# Altium project Vehicle Control Board REVAC.PrjPcb
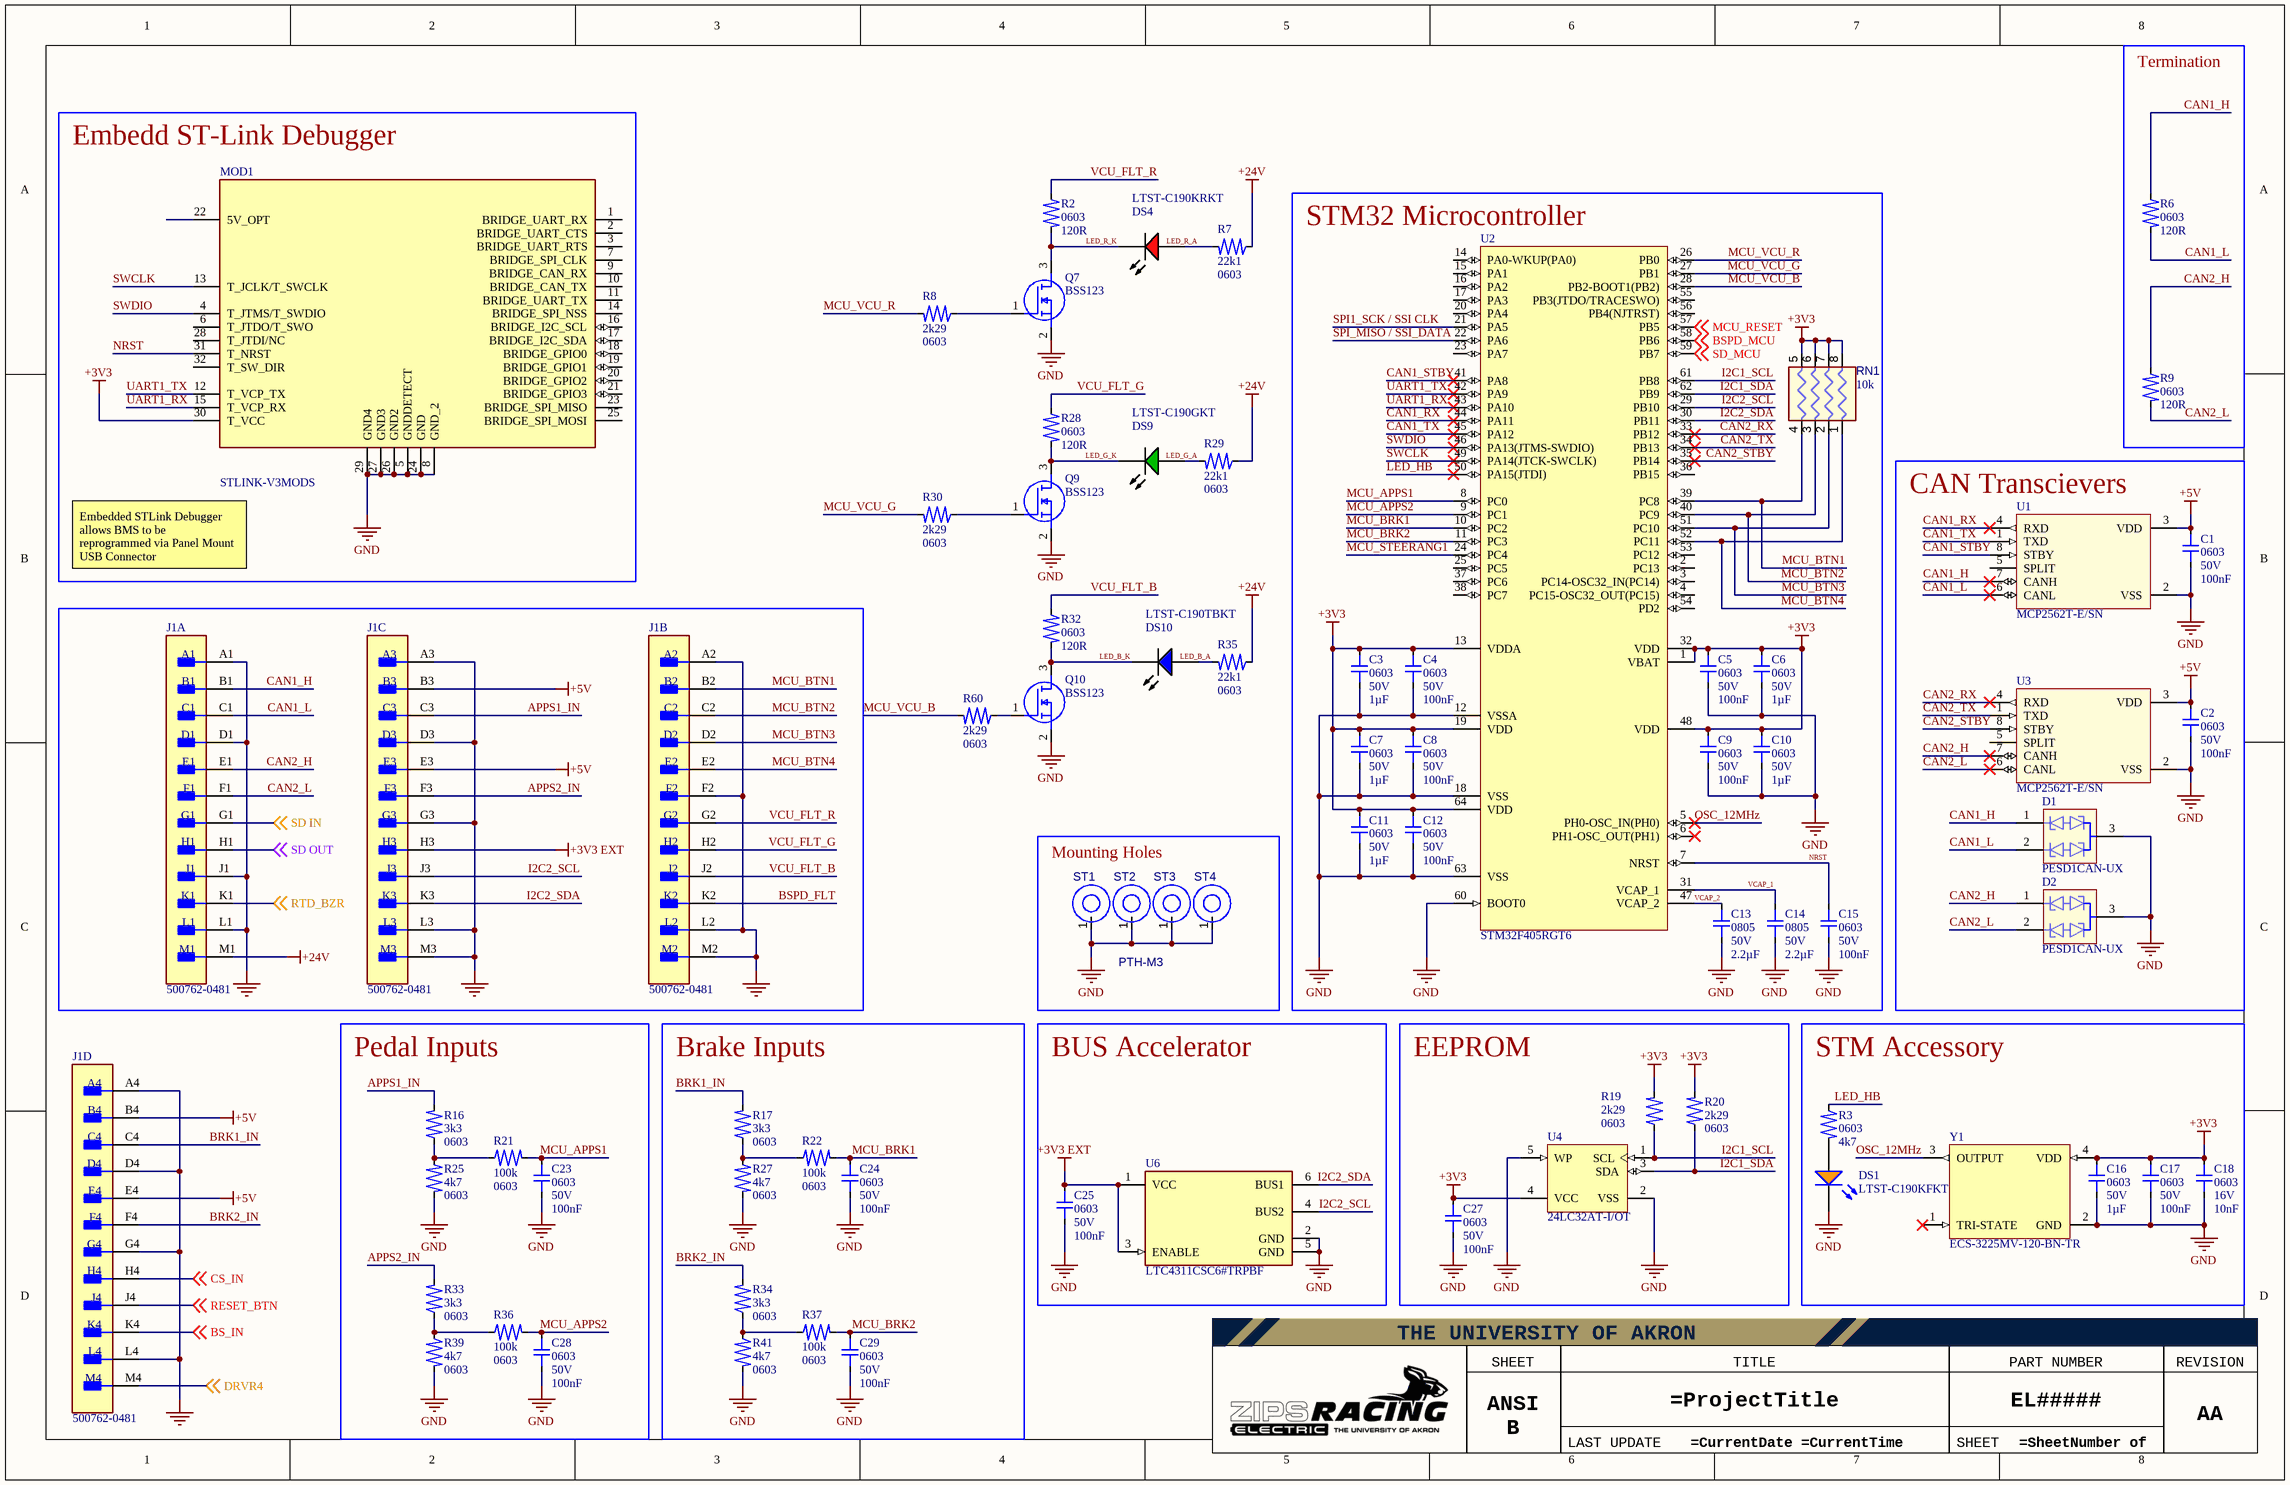
[diagram p0: STM32.SchDoc]
Comment_1: Initial Release of Schematic; Date_1: 5/17/2024; DrawnBy_1: Ethan Zifzal; PartNumber: EL#####; ProjectTitle: STM32F405 MCU Template; Revision: AA; Revision_1: AA
4 sheets, 149 parts. Net scope: global (net labels, ports and power ports of the same name join across sheets).
Board file: VCU PCB REVAC.PcbDoc
Sheets:
  Sheet1.SchDoc
  STM32.SchDoc
  Pump Fan Control.SchDoc
  BSPD.SchDoc

## Sheet Sheet1.SchDoc
size Tabloid; SheetNumber: 1; SheetTotal: 4

### Notes on the sheet
- REVISION
- DATE
- DRAWN BY
- COMMENT
- Notes
- THE UNIVERSITY OF AKRON
- SHEET SIZE
- TITLE
- PART NUMBER
- ANSI B
- LAST UPDATE
- SHEET

## Sheet STM32.SchDoc
size Tabloid; SheetNumber: 2; SheetTotal: 4

### Parts
C1  value 100nF  Footprint: 0603  Voltage: 50V  [CAP-0603-Generic]  (hidden comment: Capacitor 100nF 0603 5%)
C2  value 100nF  Footprint: 0603  Voltage: 50V  [CAP-0603-Generic]  (hidden comment: Capacitor 100nF 0603 5%)
C3  value 1µF  Footprint: 0603  Voltage: 50V  [CAP-0603-Generic]  (hidden comment: Capacitor 1uF 0603 5%)
C4  value 100nF  Footprint: 0603  Voltage: 50V  [CAP-0603-Generic]  (hidden comment: Capacitor 100nF 0603 5%)
C5  value 100nF  Footprint: 0603  Voltage: 50V  [CAP-0603-Generic]  (hidden comment: Capacitor 100nF 0603 5%)
C6  value 1µF  Footprint: 0603  Voltage: 50V  [CAP-0603-Generic]  (hidden comment: Capacitor 1uF 0603 5%)
C7  value 1µF  Footprint: 0603  Voltage: 50V  [CAP-0603-Generic]  (hidden comment: Capacitor 1uF 0603 5%)
C8  value 100nF  Footprint: 0603  Voltage: 50V  [CAP-0603-Generic]  (hidden comment: Capacitor 100nF 0603 5%)
C9  value 100nF  Footprint: 0603  Voltage: 50V  [CAP-0603-Generic]  (hidden comment: Capacitor 100nF 0603 5%)
C10  value 1µF  Footprint: 0603  Voltage: 50V  [CAP-0603-Generic]  (hidden comment: Capacitor 1uF 0603 5%)
C11  value 1µF  Footprint: 0603  Voltage: 50V  [CAP-0603-Generic]  (hidden comment: Capacitor 1uF 0603 5%)
C12  value 100nF  Footprint: 0603  Voltage: 50V  [CAP-0603-Generic]  (hidden comment: Capacitor 100nF 0603 5%)
C13  value 2.2µF  Footprint: 0805  Voltage: 50V  [CAP-0805]  (hidden comment: Capacitor 2.2F 0805 5%)
C14  value 2.2µF  Footprint: 0805  Voltage: 50V  [CAP-0805]  (hidden comment: Capacitor 2.2F 0805 5%)
C15  value 100nF  Footprint: 0603  Voltage: 50V  [CAP-0603-Generic]  (hidden comment: Capacitor 100nF 0603 5%)
C16  value 1µF  Footprint: 0603  Voltage: 50V  [CAP-0603-Generic]  (hidden comment: Capacitor 1uF 0603 5%)
C17  value 100nF  Footprint: 0603  Voltage: 50V  [CAP-0603-Generic]  (hidden comment: Capacitor 100nF 0603 5%)
C18  value 10nF  Footprint: 0603  Voltage: 16V  [CAP-0603-Generic]  (hidden comment: Capacitor 10nF 0603 5%)
C23  value 100nF  Footprint: 0603  Voltage: 50V  [CAP-0603-Generic]  (hidden comment: Capacitor 100nF 0603 5%)
C24  value 100nF  Footprint: 0603  Voltage: 50V  [CAP-0603-Generic]  (hidden comment: Capacitor 100nF 0603 5%)
C25  value 100nF  Footprint: 0603  Voltage: 50V  [CAP-0603-Generic]  (hidden comment: Capacitor 100nF 0603 5%)
C27  value 100nF  Footprint: 0603  Voltage: 50V  [CAP-0603-Generic]  (hidden comment: Capacitor 100nF 0603 5%)
C28  value 100nF  Footprint: 0603  Voltage: 50V  [CAP-0603-Generic]  (hidden comment: Capacitor 100nF 0603 5%)
C29  value 100nF  Footprint: 0603  Voltage: 50V  [CAP-0603-Generic]  (hidden comment: Capacitor 100nF 0603 5%)
D1  PESD1CAN-UX  [FP-SOT323-MFG]
D2  PESD1CAN-UX  [FP-SOT323-MFG]
DS1  LTST-C190KFKT  [LTST-C190KFKT_V]
DS4  LTST-C190KRKT  [LTST-C191KRKT_V]
DS9  LTST-C190GKT  [LTST-C190GKT_V]
DS10  LTST-C190TBKT  [LTST-C190TBKT-2_V]
J1  500762-0481  [FP-500762-0481-MFG]  (parts A,B,C,D of 4)
MOD1  STLINK-V3MODS  [STLINK-V3MODS-Footprint-1]
Q7  BSS123  [SOT96P237X111-3N]
Q9  BSS123  [SOT96P237X111-3N]
Q10  BSS123  [SOT96P237X111-3N]
R2  value 120R  Footprint: 0603  [RES-0603-Generic]  (hidden comment: Resistor 120R 0603 1%)
R3  value 4k7  Footprint: 0603  [RES-0603-Generic]  (hidden comment: Resistor 4k7 0603 1%)
R6  value 120R  Footprint: 0603  [RES-0603-Generic]  (hidden comment: Resistor 120R 0603 1%)
R7  value 22k1  Footprint: 0603  [RES-0603-Generic]  (hidden comment: Resistor 22k1 0603 1%)
R8  value 2k29  Footprint: 0603  [RES-0603-Generic]  (hidden comment: Resistor 2k49 0603 1%)
R9  value 120R  Footprint: 0603  [RES-0603-Generic]  (hidden comment: Resistor 120R 0603 1%)
R16  value 3k3  Footprint: 0603  [RES-0603-Generic]  (hidden comment: Resistor 3k3 0603 1%)
R17  value 3k3  Footprint: 0603  [RES-0603-Generic]  (hidden comment: Resistor 3k3 0603 1%)
R19  value 2k29  Footprint: 0603  [RES-0603-Generic]  (hidden comment: Resistor 2k49 0603 1%)
R20  value 2k29  Footprint: 0603  [RES-0603-Generic]  (hidden comment: Resistor 2k49 0603 1%)
R21  value 100k  Footprint: 0603  [RES-0603-Generic]  (hidden comment: Resistor 100k 0603 1%)
R22  value 100k  Footprint: 0603  [RES-0603-Generic]  (hidden comment: Resistor 100k 0603 1%)
R25  value 4k7  Footprint: 0603  [RES-0603-Generic]  (hidden comment: Resistor 4k7 0603 1%)
R27  value 4k7  Footprint: 0603  [RES-0603-Generic]  (hidden comment: Resistor 4k7 0603 1%)
R28  value 120R  Footprint: 0603  [RES-0603-Generic]  (hidden comment: Resistor 120R 0603 1%)
R29  value 22k1  Footprint: 0603  [RES-0603-Generic]  (hidden comment: Resistor 22k1 0603 1%)
R30  value 2k29  Footprint: 0603  [RES-0603-Generic]  (hidden comment: Resistor 2k49 0603 1%)
R32  value 120R  Footprint: 0603  [RES-0603-Generic]  (hidden comment: Resistor 120R 0603 1%)
R33  value 3k3  Footprint: 0603  [RES-0603-Generic]  (hidden comment: Resistor 3k3 0603 1%)
R34  value 3k3  Footprint: 0603  [RES-0603-Generic]  (hidden comment: Resistor 3k3 0603 1%)
R35  value 22k1  Footprint: 0603  [RES-0603-Generic]  (hidden comment: Resistor 22k1 0603 1%)
R36  value 100k  Footprint: 0603  [RES-0603-Generic]  (hidden comment: Resistor 100k 0603 1%)
R37  value 100k  Footprint: 0603  [RES-0603-Generic]  (hidden comment: Resistor 100k 0603 1%)
R39  value 4k7  Footprint: 0603  [RES-0603-Generic]  (hidden comment: Resistor 4k7 0603 1%)
R41  value 4k7  Footprint: 0603  [RES-0603-Generic]  (hidden comment: Resistor 4k7 0603 1%)
R60  value 2k29  Footprint: 0603  [RES-0603-Generic]  (hidden comment: Resistor 2k49 0603 1%)
RN1  value 10k  [BOUR-CAY16-J4_V]  (hidden comment: CAY16-103J4LF)
ST1  PTH-M3  [PTH-M2D5X5]  (no BOM)
ST2  PTH-M3  [PTH-M2D5X5]  (value not drawn)  (no BOM)
ST3  PTH-M3  [PTH-M2D5X5]  (value not drawn)  (no BOM)
ST4  PTH-M3  [PTH-M2D5X5]  (value not drawn)  (no BOM)
U1  MCP2562T-E/SN  [MCP2562T-E_SN-Footprint-1]
U2  STM32F405RGT6  [STM-LQFP64_V]
U3  MCP2562T-E/SN  [MCP2562T-E_SN-Footprint-1]
U4  24LC32AT-I/OT  [SOT-23-OT5_L]
U6  LTC4311CSC6#TRPBF  [FP-SC6-6-05-08-1638-IPC_A]
Y1  ECS-3225MV-120-BN-TR  [ECS-3225MV-120-BN-TR-Footprint-1]

### Blocks framed on the sheet
Termination: R6 R9
Embedd ST-Link Debugger: MOD1
STM32 Microcontroller: C3-C15 RN1 U2
CAN Transcievers: C1 C2 D1 D2 U1 U3
Mounting Holes: ST1-ST4
Pedal Inputs: C23 C28 R16 R21 R25 R33 R36 R39
Brake Inputs: C24 C29 R17 R22 R27 R34 R37 R41
BUS Accelerator: C25 U6
EEPROM: C27 R19 R20 U4
STM Accessory: C16-C18 DS1 R3 Y1

### Nets
+3V3: C3.2 C4.2 C5.2 C6.2 C7.2 C8.2 C9.2 C10.2 C11.2 C12.2 C16.2 C17.2 C18.2 C27.2 MOD1.30(T_VCC) R19.2 R20.2 RN1.5 RN1.6 RN1.7 RN1.8 U2.1(VBAT) U2.13(VDDA) U2.19(VDD) U2.32(VDD) U2.48(VDD) U2.64(VDD) U4.4(VCC) Y1.4(VDD)
+3V3 EXT: C25.2 J1.H3 U6.1(VCC) U6.3(ENABLE)
+5V: C1.2 C2.2 J1.B3 J1.B4 J1.E3 J1.E4 U1.3(VDD) U3.3(VDD)
+24V: J1.M1 R7.1 R29.1 R35.1
GND: C1.1 C2.1 C3.1 C4.1 C5.1 C6.1 C7.1 C8.1 C9.1 C10.1 C11.1 C12.1 C13.1 C14.1 C15.1 C16.1 C17.1 C18.1 C23.1 C24.1 C25.1 C27.1 C28.1 C29.1 D1.3(common_cathode) D2.3(common_cathode) DS1.2(K) J1.A1 J1.A2 J1.A3 J1.A4 J1.D1 J1.D3 J1.D4 J1.F2 J1.G3 J1.G4 J1.J1 J1.L1 J1.L2 J1.L3 J1.L4 J1.M2 J1.M3 MOD1.5(GNDDETECT) MOD1.8(GND_2) MOD1.24(GND) MOD1.26(GND2) MOD1.27(GND3) MOD1.29(GND4) Q7.2(S) Q9.2(S) Q10.2(S) R25.2 R27.2 R39.2 R41.2 ST1.1(H1) ST2.1(H1) ST3.1(H1) ST4.1(H1) U1.2(VSS) U2.12(VSSA) U2.18(VSS) U2.60(BOOT0) U2.63(VSS) U3.2(VSS) U4.2(VSS) U4.5(WP) U6.2(GND) U6.5(GND) Y1.2(GND)
APPS1_IN: J1.C3 R16.2
APPS2_IN: J1.F3 R33.2
BRK1_IN: J1.C4 R17.2
BRK2_IN: J1.F4 R34.2
BS_IN: J1.K4 ; off-sheet BS_IN
BSPD_FLT: J1.K2
BSPD_MCU: U2.58(PB6) ; off-sheet BSPD_MCU
CAN1_H: D1.1(cathode_1) J1.B1 R6.1 U1.7(CANH)
CAN1_L: D1.2(cathode_2) J1.C1 R6.2 U1.6(CANL)
CAN1_RX: U1.4(RXD) U2.44(PA11)
CAN1_STBY: U1.8(STBY) U2.41(PA8)
CAN1_TX: U1.1(TXD) U2.45(PA12)
CAN2_H: D2.1(cathode_1) J1.E1 R9.1 U3.7(CANH)
CAN2_L: D2.2(cathode_2) J1.F1 R9.2 U3.6(CANL)
CAN2_RX: U2.33(PB12) U3.4(RXD)
CAN2_STBY: U2.35(PB14) U3.8(STBY)
CAN2_TX: U2.34(PB13) U3.1(TXD)
CS_IN: J1.H4 ; off-sheet CS_IN
DRVR4: J1.M4 ; off-sheet DRVR4
I2C1_SCL: R19.1 U2.61(PB8) U4.1(SCL)
I2C1_SDA: R20.1 U2.62(PB9) U4.3(SDA)
I2C2_SCL: J1.J3 U2.29(PB10) U6.4(BUS2)
I2C2_SDA: J1.K3 U2.30(PB11) U6.6(BUS1)
LED_B_A: DS10.1(A) R35.2
LED_B_K: DS10.2(K) Q10.3(D) R32.2
LED_G_A: DS9.1(A) R29.2
LED_G_K: DS9.2(K) Q9.3(D) R28.2
LED_HB: R3.1 U2.50(PA15(JTDI))
LED_R_A: DS4.1(A) R7.2
LED_R_K: DS4.2(K) Q7.3(D) R2.2
MCU_APPS1: C23.2 R21.2 U2.8(PC0)
MCU_APPS2: C28.2 R36.2 U2.9(PC1)
MCU_BRK1: C24.2 R22.2 U2.10(PC2)
MCU_BRK2: C29.2 R37.2 U2.11(PC3)
MCU_BTN1: J1.B2 RN1.4 U2.39(PC8)
MCU_BTN2: J1.C2 RN1.3 U2.40(PC9)
MCU_BTN3: J1.D2 RN1.2 U2.51(PC10)
MCU_BTN4: J1.E2 RN1.1 U2.52(PC11)
MCU_RESET: U2.57(PB5) ; off-sheet MCU_RESET
MCU_STEERANG1: U2.24(PC4)
MCU_VCU_B: R60.2 U2.28(PB2-BOOT1(PB2))
MCU_VCU_G: R30.2 U2.27(PB1)
MCU_VCU_R: R8.2 U2.26(PB0)
NRST: C15.2 MOD1.31(T_NRST) U2.7(NRST)
OSC_12MHz: U2.5(PH0-OSC_IN(PH0)) Y1.3(OUTPUT)
RESET_BTN: J1.J4 ; off-sheet RESET_BTN
RTD_BZR: J1.K1 ; off-sheet RTD_BZR
SD IN: J1.G1 ; off-sheet SD IN
SD OUT: J1.H1 ; off-sheet SD OUT
SD_MCU: U2.59(PB7) ; off-sheet SD_MCU
SPI1_SCK / SSI CLK: U2.21(PA5)
SPI_MISO / SSI_DATA: U2.22(PA6)
SWCLK: MOD1.13(T_JCLK/T_SWCLK) U2.49(PA14(JTCK-SWCLK))
SWDIO: MOD1.4(T_JTMS/T_SWDIO) U2.46(PA13(JTMS-SWDIO))
UART1_RX: MOD1.15(T_VCP_RX) U2.43(PA10)
UART1_TX: MOD1.12(T_VCP_TX) U2.42(PA9)
VCAP_1: C14.2 U2.31(VCAP_1)
VCAP_2: C13.2 U2.47(VCAP_2)
VCU_FLT_B: J1.J2 R32.1
VCU_FLT_G: J1.H2 R28.1
VCU_FLT_R: J1.G2 R2.1
NetDS1_1: DS1.1(A) R3.2
NetQ7_1: Q7.1(G) R8.1
NetQ9_1: Q9.1(G) R30.1
NetQ10_1: Q10.1(G) R60.1
NetR16_1: R16.1 R21.1 R25.1
NetR17_1: R17.1 R22.1 R27.1
NetR33_1: R33.1 R36.1 R39.1
NetR34_1: R34.1 R37.1 R41.1

Not connected (* = marked no-connect by the designer): MOD1 1(BRIDGE_UART_RX) 2(BRIDGE_UART_CTS) 3(BRIDGE_UART_RTS) 6(T_JTDO/T_SWO) 7(BRIDGE_SPI_CLK) 9(BRIDGE_CAN_RX) 10(BRIDGE_CAN_TX) 11(BRIDGE_UART_TX) 14(BRIDGE_SPI_NSS) 16(BRIDGE_I2C_SCL) 17(BRIDGE_I2C_SDA) 18(BRIDGE_GPIO0) 19(BRIDGE_GPIO1) 20(BRIDGE_GPIO2) 21(BRIDGE_GPIO3) 22(5V_OPT) 23(BRIDGE_SPI_MISO) 25(BRIDGE_SPI_MOSI) 28(T_JTDI/NC) 32(T_SW_DIR); U1 5(SPLIT); U2 2(PC13) 3(PC14-OSC32_IN(PC14)) 4(PC15-OSC32_OUT(PC15)) 6(PH1-OSC_OUT(PH1))* 14(PA0-WKUP(PA0)) 15(PA1) 16(PA2) 17(PA3) 20(PA4) 23(PA7) 25(PC5) 36(PB15) 37(PC6) 38(PC7) 53(PC12) 54(PD2) 55(PB3(JTDO/TRACESWO)) 56(PB4(NJTRST)); U3 5(SPLIT); Y1 1(TRI-STATE)*

### Notes on the sheet
- Embedded STLink Debugger allows BMS to be reprogrammed via Panel Mount USB Connector
- THE UNIVERSITY OF AKRON
- SHEET SIZE
- TITLE
- PART NUMBER
- REVISION
- ANSI B
- LAST UPDATE
- SHEET

### Library data of the parts
C1 C2 C4 C5 C8 C9 C12 C15 C17 C23-C25 C27-C29 = CMP-00030-2: Capacitor, 0603, 5%; Max Operating Temperature: 125°C; Min Operating Temperature: -55°C
C3 C6 C7 C10 C11 C16 = CMP-00043-1: Capacitor, 0603, 5%; Min Operating Temperature: -55°C; Max Operating Temperature: 85°C
C13 C14 = CMP-00042-1: Capacitor, 0805, 5%
C18 = CMP-00044-1: Capacitor, 0603, 5%; Min Operating Temperature: -55°C; Max Operating Temperature: 125°C
D1 D2 = CMP-004-00033-2: Trans Voltage Suppressor Diode, 150W, 24V V(RWM), Bidirectional, 2 Element, Silicon
DS1 = CMP-007-00023-2: LED Uni-Color Orange, 75 mW, 30 mA, -35 to 85 degC, 2-Pin SMD, RoHS, Tape and Reel; Manufacturer: Lite-On; Power: 75mW; Luminous Intensity: 90mcd; Nominal Vf: 2V; Lens Style: Diffused; Forward Current: 20mA; Viewing Angle: 130degrees; Max Operating Temperature: 85°C; Manufacturer URL: http://www.us.liteon.com/; Package Description: 2-Pin Surface Mount Device, Body 1.6 x 0.8 mm; Package Quantity: 3000; Pins: 2; Min Operating Temperature: -55°C; Mounting Technology: SM; Colour: Orange; Packaging: TapeandReel; Case/Package: 0603; Datasheet Version: Rev. I, 09/2011; Illumination Colour: Orange; Datasheet URL: http://optoelectronics.liteon.com/upload/download/DS-22-99-0186/S_110_LTST-C190KFKT.pdf; Package Reference: C190KFKT; RoHS Compliant: True; Forward Voltage: 2V
DS4 = CMP-007-00024-2: LED Uni-Color Red, 62.5 mW, 25 mA, -30 to 85 degC, 2-Pin SMD, RoHS, Tape and Reel; Manufacturer: Lite-On; Power: 75mW; Forward Voltage: 2V; Luminous Intensity: 54mcd; Lens Style: Diffused; Viewing Angle: 130degrees; Forward Current: 20mA; Manufacturer URL: http://www.us.liteon.com/; Case/Package: 0603; Datasheet Version: Rev. F, 05/2013; Package Reference: C191KRKT; Datasheet URL: http://optoelectronics.liteon.com/upload/download/DS-22-99-0151/S_110_LTST-C190KRKT.pdf; Package Description: 2-Pin Surface Mount Device, Body 1.6 x 0.8 mm; Nominal Vf: 2V; Packaging: TapeandReel; RoHS Compliant: True; Pins: 2; Illumination Colour: Red; Colour: Red; Mounting Technology: SM; Package Quantity: 3000; Min Operating Temperature: -55°C; Max Operating Temperature: 85°C
DS9 = CMP-007-00022-2: LED Uni-Color Green, 100 mW, 30 mA, -55 to 85 degC, 2-Pin SMD, RoHS, Tape and Reel; Manufacturer: Lite-On; Power: 100mW; Forward Voltage: 2.1V; Viewing Angle: 130degrees; Forward Current: 20mA; Luminous Intensity: 6mcd; Lens Style: Clear; Manufacturer URL: http://www.us.liteon.com/; RoHS Compliant: True; Colour: Green; Package Description: 2-Pin Surface Mount Device, Body 1.6 x 0.8 mm; Datasheet URL: http://datasheet.octopart.com/LTST-C190GKT-Lite-On-datasheet-158530.pdf; Datasheet Version: Dec-06; Mounting Technology: SM; Case/Package: 0603; Package Reference: C190GKT; Packaging: TapeandReel; Min Operating Temperature: -55°C; Nominal Vf: 2.1V; Package Quantity: 3000; Illumination Colour: Green; Max Operating Temperature: 85°C; Pins: 2
DS10 = CMP-007-00026-2: LED Uni-Color Blue, 76 mW, 20 mA, -20 to 80 degC, 2-Pin SMD, RoHS, Tape and Reel; Manufacturer: Lite-On; Forward Voltage: 2.8V; Lens Style: Diffused; Luminous Intensity: 28mcd; Forward Current: 20mA; Viewing Angle: 130degrees; Nominal Vf: 3.3V; Packaging: TapeandReel; Min Operating Temperature: -20°C; Illumination Colour: Blue; Package Quantity: 3000; Pins: 2; Mounting Technology: SM; Package Reference: C190TBKT-2; Package Description: 2-Pin Surface Mount Device, Body 1.6 x 0.8 mm; RoHS Compliant: True; Datasheet URL: http://optoelectronics.liteon.com/upload/download/DS-22-99-0224/S_110_LTST-C190TBKT(0630).pdf; Datasheet Version: Rev. K, 08/2011; Manufacturer URL: http://www.us.liteon.com/; Colour: Blue; Case/Package: 0603; Max Operating Temperature: 80°C
J1 = CMP-002-00162-1: Board Connector, 48 Contact(s), 4 Row(s), Male, Right Angle, 0.098 inch Pitch, Solder Terminal, Black Insulator; Connector Type: COMBINATION LINE CONNECTOR; Mounting Technology: Board; RoHS Compliant: Yes
MOD1 = CMP-00046-2: STLINK V3 Debugger Board Module
Q7 Q9 Q10 = CMP-023-000002-1: MOSFET N-CH 100V 170MA SOT23-3; Manufacturer_Name: ON Semiconductor; Datasheet Link: http://uk.rs-online.com/web/p/products/6710321; Mouser Price/Stock: https://www.mouser.co.uk/ProductDetail/ON-Semiconductor-Fairchild/BSS123?qs=FOlmdCx%252BAA2Kf8SEB3qLYA%3D%3D; Arrow Part Number: BSS123; Arrow Price/Stock: https://www.arrow.com/en/products/bss123/on-semiconductor; Manufacturer_Part_Number: BSS123; Source: Zips_Racing_Electric.SchLib; Design Item ID: BSS123; Height: 1.11mm; Mouser Part Number: 512-BSS123
R2 R6 R9 R28 R32 = CMP-00031-1: Resistor, 0603, 1%, 1/10W; Power: 100mW; Datasheet: https://www.seielect.com/catalog/sei-rmcf_rmcp.pdf; Max Operating Temperature: 155°C; Tolerance: 1%; Min Operating Temperature: -55°C
R3 R25 R27 R39 R41 = CMP-00023-3: Resistor, 0603, 1%, 1/10W; Power: 100mW; Tolerance: 1%; Datasheet: https://www.seielect.com/catalog/sei-rmcf_rmcp.pdf; Max Operating Temperature: 155°C; Min Operating Temperature: -55°C
R7 R29 R35 = CMP-00029-1: Resistor, 0603, 1%, 1/10W; Power: 100mW; Tolerance: 1%; Datasheet: https://www.seielect.com/catalog/sei-rmcf_rmcp.pdf; Max Operating Temperature: 155°C; Min Operating Temperature: -55°C
R8 R19 R20 R30 R60 = CMP-00028-1: Resistor, 0603, 1%, 1/10W; Power: 100mW; Max Operating Temperature: 155°C; Min Operating Temperature: -55°C; Tolerance: 1%; Datasheet: https://www.seielect.com/catalog/sei-rmcf_rmcp.pdf
R16 R17 R33 R34 = CMP-00056-1: Resistor, 0603, 1%, 1/10W; Power: 100mW; Tolerance: 1%; Min Operating Temperature: -55°C; Max Operating Temperature: 155°C; Datasheet: https://www.seielect.com/catalog/sei-rmcf_rmcp.pdf
R21 R22 R36 R37 = CMP-00052-1: Resistor, 0603, 1%, 1/10W; Power: 100mW; Min Operating Temperature: -55°C; Tolerance: 1%; Max Operating Temperature: 155°C; Datasheet: https://www.seielect.com/catalog/sei-rmcf_rmcp.pdf
RN1 = CMP-009-00043-4: Chip Resistor Array, 10 KOhm, +/- 5%, 62.5 mW, -55 to 125 degC, 8-Pin SMD, RoHS, Tape and Reel; Manufacturer: Bourns; Elements: 4; Power: 248mW; Voltage Rating: 50V; Min Operating Temperature: -55°C; Package Description: 8-Pin Surface Mount Device, Body 1.6 x 3.2 mm, Pitch 0.8 mm; Pins: 8; Max Operating Temperature: 125°C; Packaging: CutTape; RoHS Compliant: True; Tolerance: 5%; Case/Package: 1205; Datasheet URL: http://www.bourns.com/docs/Product-Datasheets/CATCAY.pdf; Manufacturer URL: http://www.bourns.com/; Package Reference: CAY16-J4; Mounting Technology: SM; Datasheet Version: Jan-15; Package Quantity: 1
ST1-ST4 = CMP-00028-00008-6: M3 Plated Thru-Hole  (3.2mm), 7mm pad, 10 mm keep out zone; Pins: 1
U1 U3 = CMP-000001-7: IC TXRX CAN 8SOIC; Receiver Hysteresis: 200mV; Propagation Delay: 125ns; Min Supply Voltage: 1.8V; Operating Supply Current: 70mA; Max Supply Voltage: 5.5V; Simplex/Duplex: Half Duplex; Data Rate: 1Mbps; Packaging: Cut Tape; Mounting Technology: Surface Mount; Lead Free: Lead Free; Case/Package: SOIC; Package Quantity: 3300; Min Operating Temperature: -40°C; Max Operating Temperature: 125°C; Type: Integrated Circuit (IC); Pins: 8
U2 = CMP-020-00030-5: RISC Microcontroller, 32-Bit, FLASH, CORTEX-M4 CPU, 168MHz, CMOS, PQFP64; Max Supply Voltage: 3.6V; Clock Frequency: 50MHz; Min Supply Voltage: 1.8V; Nominal Supply Voltage: 3.3V; Pins: 64; RoHS Compliant: Yes; Case/Package: LFQFP; Min Operating Temperature: -40°C; Max Operating Temperature: 85°C
U4 = CMP-019-00068-2: EEPROM, 4KX8, Serial, CMOS, PDSO5; Memory Size: 4096; Clock Frequency: 400kHz; Min Supply Voltage: 2.5V; Max Supply Voltage: 5.5V; Max Operating Temperature: 85°C; Memory Format: EEPROM; Case/Package: LSSOP; RoHS Compliant: Yes; Min Operating Temperature: -40°C; Pins: 5
U6 = CMP-031-00034-1: Analog Circuit, 1 Func, PDSO6; Min Supply Voltage: 1.6V; Max Supply Voltage: 5.5V; Min Operating Temperature: 0°C; Pins: 6; Max Operating Temperature: 70°C; RoHS Compliant: Yes; Case/Package: VSSOP
Y1 = CMP-003-00034-2: HCMOS Output Clock Oscillator, 12MHz Nom; Frequency: 12MHz

## Sheet Pump Fan Control.SchDoc
size Tabloid; SheetNumber: 3; SheetTotal: 4
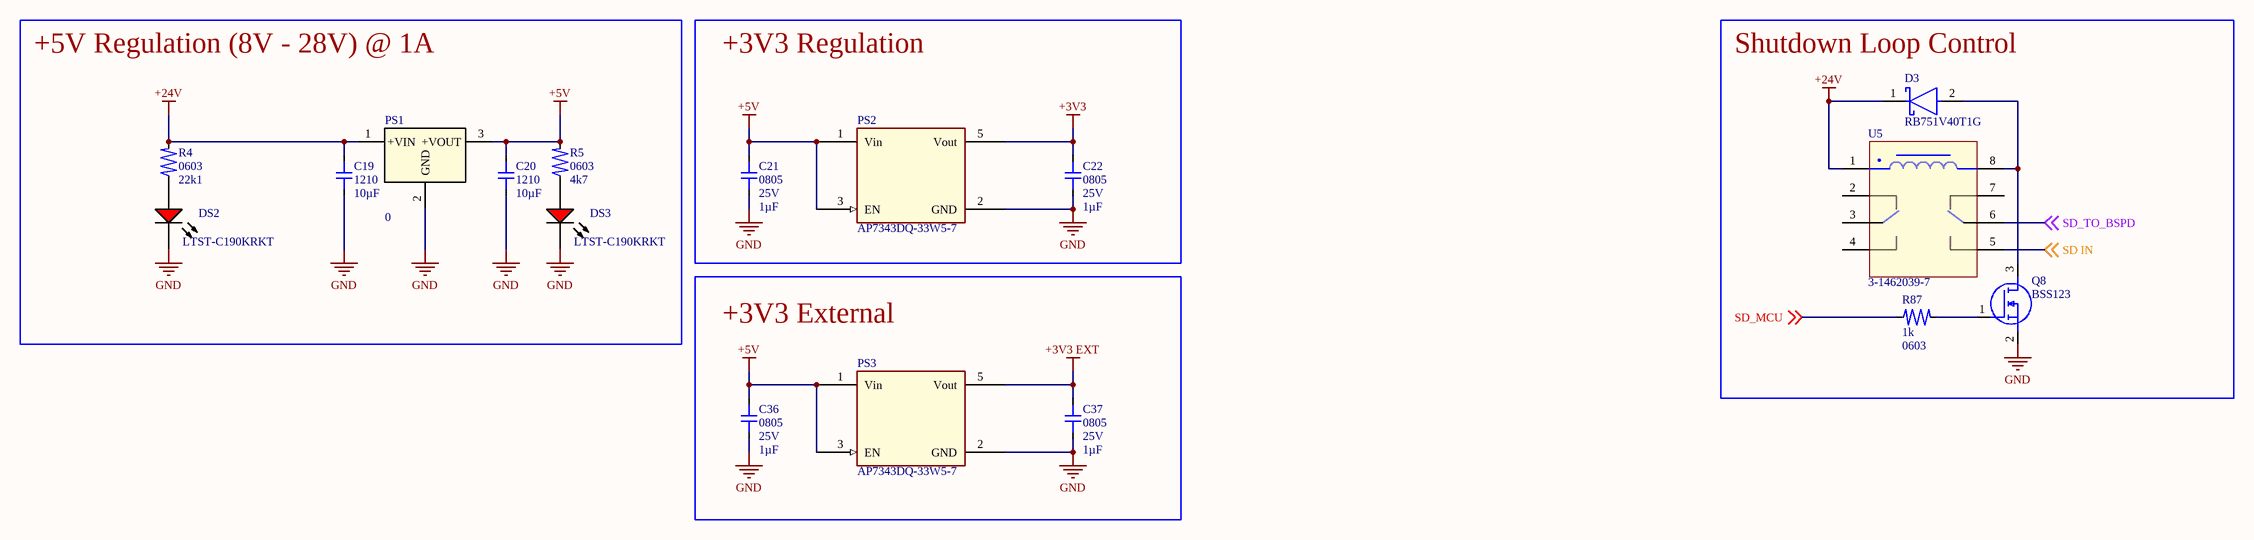
[diagram p1: Pump Fan Control.SchDoc]

### Parts
C19  value 10µF  Footprint: 1210  [FP-1210-L_3_2_0_3-W_2_5_0-MFG]  (hidden comment: Capacitor 10uF 1210 50V)
C20  value 10µF  Footprint: 1210  [FP-1210-L_3_2_0_3-W_2_5_0-MFG]  (hidden comment: Capacitor 10uF 1210 50V)
C21  value 1µF  Footprint: 0805  Voltage: 25V  [CAP-0805]  (hidden comment: Capacitor 1uF 0805 25V)
C22  value 1µF  Footprint: 0805  Voltage: 25V  [CAP-0805]  (hidden comment: Capacitor 1uF 0805 25V)
C36  value 1µF  Footprint: 0805  Voltage: 25V  [CAP-0805]  (hidden comment: Capacitor 1uF 0805 25V)
C37  value 1µF  Footprint: 0805  Voltage: 25V  [CAP-0805]  (hidden comment: Capacitor 1uF 0805 25V)
D3  RB751V40T1G  [FP-477-02-MFG]
DS2  LTST-C190KRKT  [LTST-C191KRKT_V]
DS3  LTST-C190KRKT  [LTST-C191KRKT_V]
PS1  value 0  [CONV_R-78E5.0-1.0]  (hidden comment: R-78E5.0-1.0)
PS2  AP7343DQ-33W5-7  [SOT95P285X140-5N]
PS3  AP7343DQ-33W5-7  [SOT95P285X140-5N]
Q8  BSS123  [SOT96P237X111-3N]
R4  value 22k1  Footprint: 0603  [RES-0603-Generic]  (hidden comment: Resistor 22k1 0603 1%)
R5  value 4k7  Footprint: 0603  [RES-0603-Generic]  (hidden comment: Resistor 4k7 0603 1%)
R87  value 1k  Footprint: 0603  [RES-0603-Generic]  (hidden comment: Resistor 1k 0603 1%)
U5  3-1462039-7  [3-1462039-7-Footprint-1]

### Blocks framed on the sheet
+5V Regulation (8V - 28V) @ 1A: C19 C20 DS2 DS3 PS1 R4 R5
+3V3 Regulation: C21 C22 PS2
Shutdown Loop Control: D3 Q8 R87 U5
+3V3 External: C36 C37 PS3

### Nets
+3V3: C22.2 PS2.5(Vout)
+3V3 EXT: C37.2 PS3.5(Vout)
+5V: C20.2 C21.2 C36.2 PS1.3(+VOUT) PS2.1(Vin) PS2.3(EN) PS3.1(Vin) PS3.3(EN) R5.2
+24V: C19.2 D3.1(C) PS1.1(+VIN) R4.2 U5.1
GND: C19.1 C20.1 C21.1 C22.1 C36.1 C37.1 DS2.2(K) DS3.2(K) PS1.2(GND) PS2.2(GND) PS3.2(GND) Q8.2(S)
SD IN: U5.5 ; off-sheet SD IN
SD_MCU: R87.1 ; off-sheet SD_MCU
SD_TO_BSPD: U5.6 ; off-sheet SD_TO_BSPD
NetD3_2: D3.2(A) Q8.3(D) U5.8
NetDS2_1: DS2.1(A) R4.1
NetDS3_1: DS3.1(A) R5.1
NetQ8_1: Q8.1(G) R87.2

Not connected (* = marked no-connect by the designer): PS2 4(NC); PS3 4(NC); U5 2 3 4 7

### Notes on the sheet
- THE UNIVERSITY OF AKRON
- SHEET SIZE
- TITLE
- PART NUMBER
- REVISION
- ANSI B
- LAST UPDATE
- SHEET
- (in symbol CMP-008-00016-1) .

### Library data of the parts
C19 C20 = CMP-001-00122-1: Capacitor 1210; Capacitor Type: Ceramic; Max Operating Temperature: 85°C; Pins: 2; Mounting Technology: Surface Mount; Case/Package: 1210; Min Operating Temperature: -55°C; RoHS Compliant: Yes; Voltage Rating: 50V
C21 C22 C36 C37 = CMP-00045-1: Capacitor, 0805
D3 = CMP-004-00075-1: Rectifier Diode, Schottky, 1 Phase, 1 Element, 0.03A, 40V V(RRM), Silicon; Forward Voltage: 370mV; Pins: 2; RoHS Compliant: Yes; Max Operating Temperature: 150°C; Min Operating Temperature: -55°C
DS2 DS3 = CMP-007-00024-2: as DS4 on sheet STM32; Manufacturer URL: http://www.us.liteon.com/; Case/Package: 0603; Datasheet Version: Rev. F, 05/2013; Package Reference: C191KRKT; Datasheet URL: http://optoelectronics.liteon.com/upload/download/DS-22-99-0151/S_110_LTST-C190KRKT.pdf; Package Description: 2-Pin Surface Mount Device, Body 1.6 x 0.8 mm; Nominal Vf: 2V; Packaging: TapeandReel; RoHS Compliant: True; Pins: 2; Illumination Colour: Red; Colour: Red; Mounting Technology: SM; Package Quantity: 3000; Min Operating Temperature: -55°C; Max Operating Temperature: 85°C
PS1 = CMP-009-00214-2: Linear Regulator Replacement DC DC Converter 1 Output 5V - - 1A 8V - 28V Input; MF: Recom Power; Price: None; Availability: Unavailable; SnapEDA_Link: https://www.snapeda.com/parts/R-78E5.0-1.0/Recom%20Power/view-part/557753/?ref=snap; Case/Package: SIP-3 Recom Power; Design Item ID: R-78E5.0-1.0; MP: R-78E5.0-1.0; Source: Zips_Racing_Electric.SchLib
PS2 PS3 = CMP-019-00053-6: Fixed Positive LDO Regulator; Min Supply Voltage: 1.7V; Output Current: 300mA; Max Supply Voltage: 5.25V; Output Voltage: 3.3V; Dropout Voltage: 310mV; Mounting Technology: SMT; Min Operating Temperature: -40°C; Pins: 5; Case/Package: SOT-25; Max Operating Temperature: 125°C
Q8 = CMP-023-000002-1: as Q7 on sheet STM32; Datasheet Link: http://uk.rs-online.com/web/p/products/6710321; Mouser Price/Stock: https://www.mouser.co.uk/ProductDetail/ON-Semiconductor-Fairchild/BSS123?qs=FOlmdCx%252BAA2Kf8SEB3qLYA%3D%3D; Arrow Part Number: BSS123; Arrow Price/Stock: https://www.arrow.com/en/products/bss123/on-semiconductor; Manufacturer_Part_Number: BSS123; Source: Zips_Racing_Electric.SchLib; Design Item ID: BSS123; Height: 1.11mm; Mouser Part Number: 512-BSS123
R4 = CMP-00029-1: Resistor, 0603, 1%, 1/10W; Power: 100mW; Tolerance: 1%; Datasheet: https://www.seielect.com/catalog/sei-rmcf_rmcp.pdf; Max Operating Temperature: 155°C; Min Operating Temperature: -55°C
R5 = CMP-00023-3: Resistor, 0603, 1%, 1/10W; Power: 100mW; Tolerance: 1%; Datasheet: https://www.seielect.com/catalog/sei-rmcf_rmcp.pdf; Max Operating Temperature: 155°C; Min Operating Temperature: -55°C
R87 = CMP-00021-7: Resistor, 0603, 1k; Power: 100mW; Max Operating Temperature: 155°C; Min Operating Temperature: -55°C; Datasheet: https://www.seielect.com/catalog/sei-rmcf_rmcp.pdf; Tolerance: 1%
U5 = CMP-008-00016-1: RF Relay, DPDT, Momentary, 0.008A (Coil), 24VDC (Coil), 200mW (Coil), 5A (Contact), 220VDC (Contact), 900MHz, 60W (RF Input), DC Input, AC/DC Output, Surface Mount-Straight; Operate Time: 8ms; Min Operating Temperature: -40°C; Mounting Technology: Surface Mount; Max Operating Temperature: 85°C; RoHS Compliant: Yes

## Sheet BSPD.SchDoc
size Tabloid; SheetNumber: 4; SheetTotal: 4
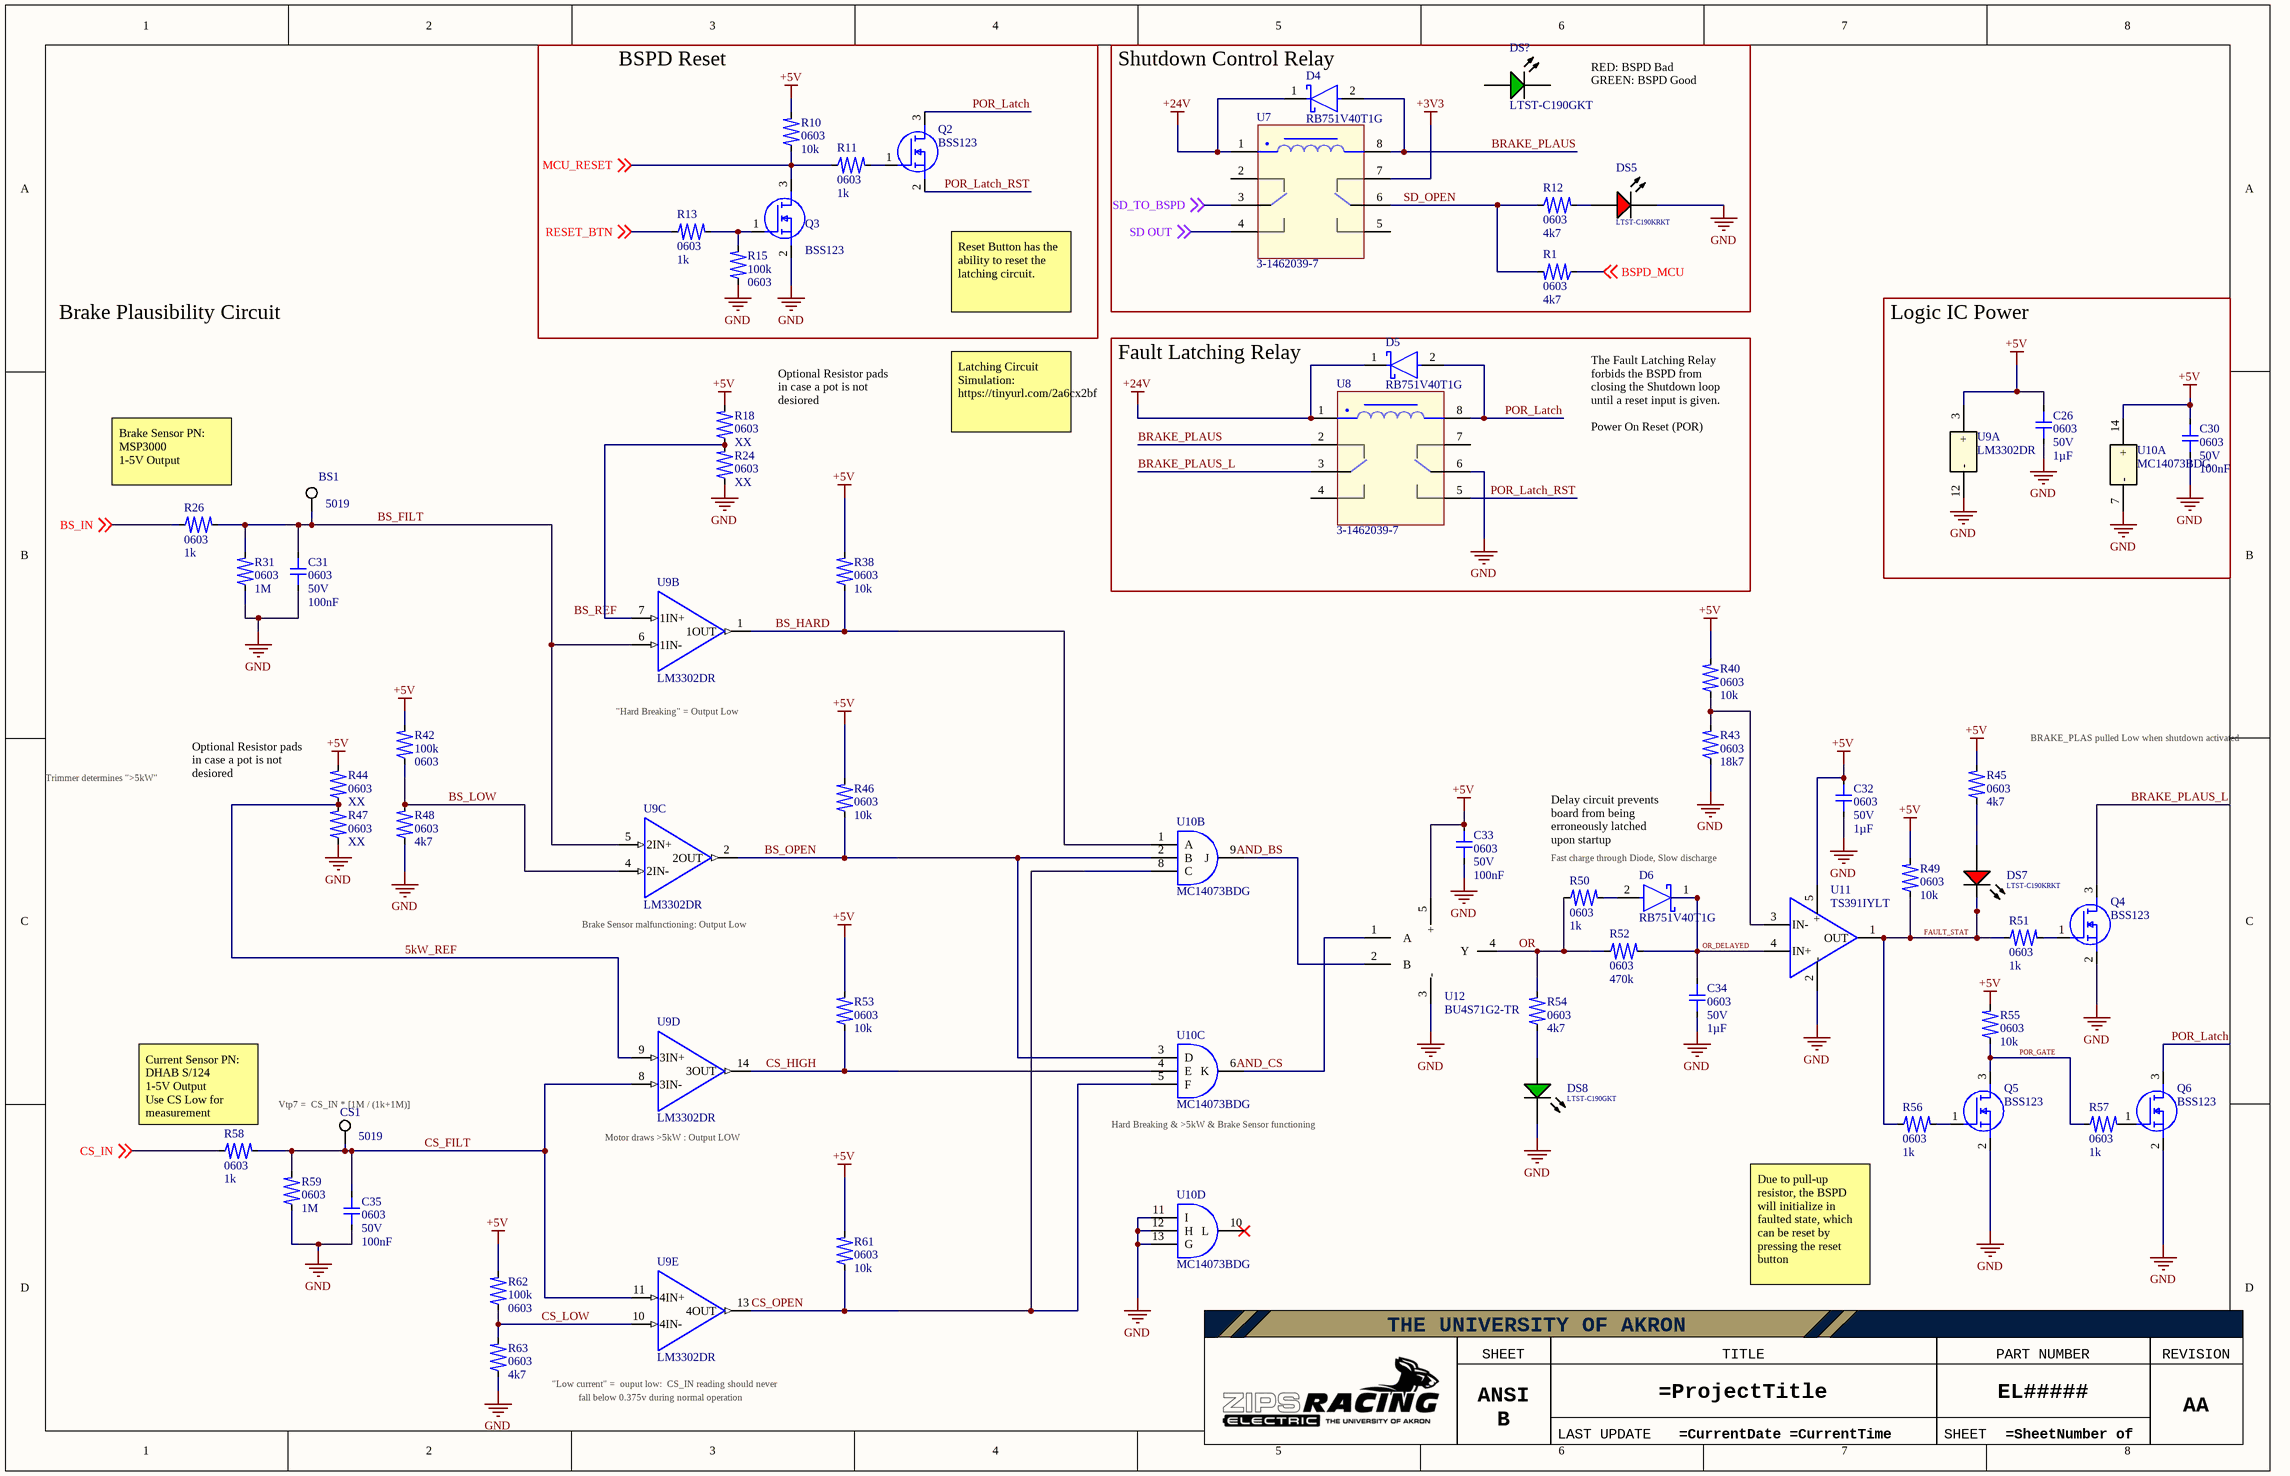
[diagram p2: BSPD.SchDoc]

### Parts
BS1  5019  [KSTN-5019_V]
C26  value 1µF  Footprint: 0603  Voltage: 50V  [CAP-0603-Generic]  (hidden comment: Capacitor 1uF 0603 5%)
C30  value 100nF  Footprint: 0603  Voltage: 50V  [CAP-0603-Generic]  (hidden comment: Capacitor 100nF 0603 5%)
C31  value 100nF  Footprint: 0603  Voltage: 50V  [CAP-0603-Generic]  (hidden comment: Capacitor 100nF 0603 5%)
C32  value 1µF  Footprint: 0603  Voltage: 50V  [CAP-0603-Generic]  (hidden comment: Capacitor 1uF 0603 5%)
C33  value 100nF  Footprint: 0603  Voltage: 50V  [CAP-0603-Generic]  (hidden comment: Capacitor 100nF 0603 5%)
C34  value 1µF  Footprint: 0603  Voltage: 50V  [CAP-0603-Generic]  (hidden comment: Capacitor 1uF 0603 5%)
C35  value 100nF  Footprint: 0603  Voltage: 50V  [CAP-0603-Generic]  (hidden comment: Capacitor 100nF 0603 5%)
CS1  5019  [KSTN-5019_V]
D4  RB751V40T1G  [FP-477-02-MFG]
D5  RB751V40T1G  [FP-477-02-MFG]
D6  RB751V40T1G  [FP-477-02-MFG]
DS5  LTST-C190KRKT  [LTST-C191KRKT_V]
DS7  LTST-C190KRKT  [LTST-C191KRKT_V]
DS8  LTST-C190GKT  [LTST-C190GKT_V]
DS?  LTST-C190GKT  [LTST-C190GKT_V]
Q2  BSS123  [SOT96P237X111-3N]
Q3  BSS123  [SOT96P237X111-3N]
Q4  BSS123  [SOT96P237X111-3N]
Q5  BSS123  [SOT96P237X111-3N]
Q6  BSS123  [SOT96P237X111-3N]
R1  value 4k7  Footprint: 0603  [RES-0603-Generic]  (hidden comment: Resistor 4k7 0603 1%)
R10  value 10k  Footprint: 0603  [RES-0603-Generic]  (hidden comment: Resistor 10k 0603 1%)
R11  value 1k  Footprint: 0603  [RES-0603-Generic]  (hidden comment: Resistor 1k 0603 1%)
R12  value 4k7  Footprint: 0603  [RES-0603-Generic]  (hidden comment: Resistor 4k7 0603 1%)
R13  value 1k  Footprint: 0603  [RES-0603-Generic]  (hidden comment: Resistor 1k 0603 1%)
R15  value 100k  Footprint: 0603  [RES-0603-Generic]  (hidden comment: Resistor 100k 0603 1%)
R18  value XX  Footprint: 0603  [RES-0603-Generic]  (hidden comment: Resistor XX 0603 1%)
R24  value XX  Footprint: 0603  [RES-0603-Generic]  (hidden comment: Resistor XX 0603 1%)
R26  value 1k  Footprint: 0603  [RES-0603-Generic]  (hidden comment: Resistor 1k 0603 1%)
R31  value 1M  Footprint: 0603  [RES-0603-Generic]  (hidden comment: Resistor 1M 0603 1%)
R38  value 10k  Footprint: 0603  [RES-0603-Generic]  (hidden comment: Resistor 10k 0603 1%)
R40  value 10k  Footprint: 0603  [RES-0603-Generic]  (hidden comment: Resistor 10k 0603 1%)
R42  value 100k  Footprint: 0603  [RES-0603-Generic]  (hidden comment: Resistor 100k 0603 1%)
R43  value 18k7  Footprint: 0603  [RES-0603-Generic]  (hidden comment: Resistor 10k 0603 1%)
R44  value XX  Footprint: 0603  [RES-0603-Generic]  (hidden comment: Resistor XX 0603 1%)
R45  value 4k7  Footprint: 0603  [RES-0603-Generic]  (hidden comment: Resistor 4k7 0603 1%)
R46  value 10k  Footprint: 0603  [RES-0603-Generic]  (hidden comment: Resistor 10k 0603 1%)
R47  value XX  Footprint: 0603  [RES-0603-Generic]  (hidden comment: Resistor XX 0603 1%)
R48  value 4k7  Footprint: 0603  [RES-0603-Generic]  (hidden comment: Resistor 4k7 0603 1%)
R49  value 10k  Footprint: 0603  [RES-0603-Generic]  (hidden comment: Resistor 10k 0603 1%)
R50  value 1k  Footprint: 0603  [RES-0603-Generic]  (hidden comment: Resistor 1k 0603 1%)
R51  value 1k  Footprint: 0603  [RES-0603-Generic]  (hidden comment: Resistor 1k 0603 1%)
R52  value 470k  Footprint: 0603  [RES-0603-Generic]  (hidden comment: Resistor 470k 0603 1%)
R53  value 10k  Footprint: 0603  [RES-0603-Generic]  (hidden comment: Resistor 10k 0603 1%)
R54  value 4k7  Footprint: 0603  [RES-0603-Generic]  (hidden comment: Resistor 4k7 0603 1%)
R55  value 10k  Footprint: 0603  [RES-0603-Generic]  (hidden comment: Resistor 10k 0603 1%)
R56  value 1k  Footprint: 0603  [RES-0603-Generic]  (hidden comment: Resistor 1k 0603 1%)
R57  value 1k  Footprint: 0603  [RES-0603-Generic]  (hidden comment: Resistor 1k 0603 1%)
R58  value 1k  Footprint: 0603  [RES-0603-Generic]  (hidden comment: Resistor 1k 0603 1%)
R59  value 1M  Footprint: 0603  [RES-0603-Generic]  (hidden comment: Resistor 1M 0603 1%)
R61  value 10k  Footprint: 0603  [RES-0603-Generic]  (hidden comment: Resistor 10k 0603 1%)
R62  value 100k  Footprint: 0603  [RES-0603-Generic]  (hidden comment: Resistor 100k 0603 1%)
R63  value 4k7  Footprint: 0603  [RES-0603-Generic]  (hidden comment: Resistor 4k7 0603 1%)
U7  3-1462039-7  [3-1462039-7-Footprint-1]
U8  3-1462039-7  [3-1462039-7-Footprint-1]
U9  LM3302DR  [SOIC127P600X175-14N]  (parts A,B,C,D,E of 5)
U10  MC14073BDG  [MC14073BDG-Footprint-1]  (parts A,B,C,D of 4)
U11  TS391IYLT  [SOT23-5_STM]
U12  BU4S71G2-TR  [SSOP5_ROM-L]

### Blocks framed on the sheet
BSPD Reset: Q2 Q3 R10 R11 R13 R15
Shutdown Control Relay: D4 DS5 DS? R1 R12 U7
Logic IC Power: C26 C30 U9 U10
Fault Latching Relay: D5 U8

### Nets
+3V3: U7.7
+5V: C26.2 C30.2 C32.2 C33.2 R10.2 R18.2 R38.2 R40.2 R42.2 R44.2 R45.2 R46.2 R49.2 R53.2 R55.2 R61.2 R62.2 U9.3(+) U10.14(+) U11.5(+) U12.5(+)
+24V: D4.1(C) D5.1(C) U7.1 U8.1
GND: C26.1 C30.1 C31.1 C32.1 C33.1 C34.1 C35.1 DS5.2(K) DS8.2(K) Q3.2(S) Q4.2(S) Q5.2(S) Q6.2(S) R15.1 R24.1 R31.1 R43.1 R47.1 R48.1 R59.1 R63.1 U8.6 U9.12(-) U10.7(-) U10.11(I) U10.12(H) U10.13(G) U11.2(-) U12.3(-)
5kW_REF: R44.1 R47.2 U9.9(3IN+)
AND_BS: U10.9(J) U12.2(B)
AND_CS: U10.6(K) U12.1(A)
BRAKE_PLAUS: D4.2(A) U7.8 U8.2
BRAKE_PLAUS_L: Q4.3(D) U8.3
BS_FILT: BS1.1 C31.2 R26.2 R31.2 U9.5(2IN+) U9.6(1IN-)
BS_HARD: R38.1 U9.1(1OUT) U10.1(A)
BS_IN: R26.1 ; off-sheet BS_IN
BS_LOW: R42.1 R48.2 U9.4(2IN-)
BS_OPEN: R46.1 U9.2(2OUT) U10.2(B) U10.3(D)
BS_REF: R18.1 R24.2 U9.7(1IN+)
BSPD_MCU: R1.1 ; off-sheet BSPD_MCU
CS_FILT: C35.2 CS1.1 R58.2 R59.2 U9.8(3IN-) U9.11(4IN+)
CS_HIGH: R53.1 U9.14(3OUT) U10.4(E)
CS_IN: R58.1 ; off-sheet CS_IN
CS_LOW: R62.1 R63.2 U9.10(4IN-)
CS_OPEN: R61.1 U9.13(4OUT) U10.5(F) U10.8(C)
FAULT_STAT: DS7.2(K) R49.1 R51.1 R56.1 U11.1(OUT)
MCU_RESET: Q3.3(D) R10.1 R11.1 ; off-sheet MCU_RESET
OR: R50.1 R52.1 R54.2 U12.4(Y)
OR_DELAYED: C34.2 D6.1(C) R52.2 U11.4(IN+)
POR_GATE: Q5.3(D) R55.1 R57.1
POR_Latch: D5.2(A) Q2.3(D) Q6.3(D) U8.8
POR_Latch_RST: Q2.2(S) U8.5
RESET_BTN: R13.1 ; off-sheet RESET_BTN
SD OUT: U7.4 ; off-sheet SD OUT
SD_OPEN: R1.2 R12.1 U7.6
SD_TO_BSPD: U7.3 ; off-sheet SD_TO_BSPD
NetD6_2: D6.2(A) R50.2
NetDS5_1: DS5.1(A) R12.2
NetDS7_1: DS7.1(A) R45.1
NetDS8_1: DS8.1(A) R54.1
NetQ2_1: Q2.1(G) R11.2
NetQ3_1: Q3.1(G) R13.2 R15.2
NetQ4_1: Q4.1(G) R51.2
NetQ5_1: Q5.1(G) R56.2
NetQ6_1: Q6.1(G) R57.2
NetR40_1: R40.1 R43.2 U11.3(IN-)

Not connected (* = marked no-connect by the designer): DS? 1(A) 2(K); U7 2 5; U8 4 7; U10 10(L)*

### Notes on the sheet
- RED: BSPD Bad
  GREEN: BSPD Good
- Brake Plausibility Circuit
- Reset Button has the ability to reset the latching circuit.
- Optional Resistor pads in case a pot is not desiored
- Latching Circuit Simulation:
  https://tinyurl.com/2a6cx2bf
- The Fault Latching Relay forbids the BSPD from closing the Shutdown loop until a reset input is given.
- (near R26) Brake Sensor PN:
  MSP3000
  1-5V Output
- Power On Reset (POR)
- "Hard Breaking" = Output Low
- BRAKE_PLAS pulled Low when shutdown activated
- Trimmer determines ">5kW"
- Fast charge through Diode, Slow discharge
- Delay circuit prevents board from being erroneously latched upon startup
- (near U9) Brake Sensor malfunctioning: Output Low
- (near CS1) Vtp7 =  CS_IN * [1M / (1k+1M)]
- (near R58) Current Sensor PN:
  DHAB S/124
  1-5V Output
  Use CS Low for measurement
- (near U9) Motor draws >5kW : Output LOW
- (near U10) Hard Breaking & >5kW & Brake Sensor functioning
- (near R56) Due to pull-up resistor, the BSPD will initialize in faulted state, which can be reset by pressing the reset button
- "Low current" =  ouput low:  CS_IN reading should never
- fall below 0.375v during normal operation
- THE UNIVERSITY OF AKRON
- SHEET SIZE
- TITLE
- PART NUMBER
- REVISION
- ANSI B
- LAST UPDATE
- SHEET
- (in symbol CMP-008-00016-1) .

### Library data of the parts
BS1 CS1 = CMP-00012-1: Interconnection Device
C26 C32 C34 = CMP-00043-1: Capacitor, 0603, 5%; Min Operating Temperature: -55°C; Max Operating Temperature: 85°C
C30 C31 C33 C35 = CMP-00030-2: Capacitor, 0603, 5%; Max Operating Temperature: 125°C; Min Operating Temperature: -55°C
D4-D6 = CMP-004-00075-1: as D3 on sheet Pump Fan Control; Pins: 2; RoHS Compliant: Yes; Max Operating Temperature: 150°C; Min Operating Temperature: -55°C
DS5 DS7 = CMP-007-00024-2: as DS4 on sheet STM32; Manufacturer URL: http://www.us.liteon.com/; Case/Package: 0603; Datasheet Version: Rev. F, 05/2013; Package Reference: C191KRKT; Datasheet URL: http://optoelectronics.liteon.com/upload/download/DS-22-99-0151/S_110_LTST-C190KRKT.pdf; Package Description: 2-Pin Surface Mount Device, Body 1.6 x 0.8 mm; Nominal Vf: 2V; Packaging: TapeandReel; RoHS Compliant: True; Pins: 2; Illumination Colour: Red; Colour: Red; Mounting Technology: SM; Package Quantity: 3000; Min Operating Temperature: -55°C; Max Operating Temperature: 85°C
DS8 DS? = CMP-007-00022-2: as DS9 on sheet STM32; Manufacturer URL: http://www.us.liteon.com/; RoHS Compliant: True; Colour: Green; Package Description: 2-Pin Surface Mount Device, Body 1.6 x 0.8 mm; Datasheet URL: http://datasheet.octopart.com/LTST-C190GKT-Lite-On-datasheet-158530.pdf; Datasheet Version: Dec-06; Mounting Technology: SM; Case/Package: 0603; Package Reference: C190GKT; Packaging: TapeandReel; Min Operating Temperature: -55°C; Nominal Vf: 2.1V; Package Quantity: 3000; Illumination Colour: Green; Max Operating Temperature: 85°C; Pins: 2
Q2-Q6 = CMP-023-000002-1: as Q7 on sheet STM32; Datasheet Link: http://uk.rs-online.com/web/p/products/6710321; Mouser Price/Stock: https://www.mouser.co.uk/ProductDetail/ON-Semiconductor-Fairchild/BSS123?qs=FOlmdCx%252BAA2Kf8SEB3qLYA%3D%3D; Arrow Part Number: BSS123; Arrow Price/Stock: https://www.arrow.com/en/products/bss123/on-semiconductor; Manufacturer_Part_Number: BSS123; Source: Zips_Racing_Electric.SchLib; Design Item ID: BSS123; Height: 1.11mm; Mouser Part Number: 512-BSS123
R1 R12 R45 R48 R54 R63 = CMP-00023-3: Resistor, 0603, 1%, 1/10W; Power: 100mW; Tolerance: 1%; Datasheet: https://www.seielect.com/catalog/sei-rmcf_rmcp.pdf; Max Operating Temperature: 155°C; Min Operating Temperature: -55°C
R10 R38 R40 R43 R46 R49 R53 R55 R61 = CMP-00020-12: Resistor, 0603, 10k; Power: 100mW; Minimum Operating Temperature: -55°C; Tolerance: 1%; Maximum Operating Temperature: 155°C; Max Operating Temperature: 155°C; Min Operating Temperature: -55°C; Datasheet: https://www.seielect.com/catalog/sei-rmcf_rmcp.pdf
R11 R13 R26 R50 R51 R56-R58 = CMP-00021-7: Resistor, 0603, 1k; Power: 100mW; Max Operating Temperature: 155°C; Min Operating Temperature: -55°C; Datasheet: https://www.seielect.com/catalog/sei-rmcf_rmcp.pdf; Tolerance: 1%
R15 R42 R62 = CMP-00052-1: Resistor, 0603, 1%, 1/10W; Power: 100mW; Min Operating Temperature: -55°C; Tolerance: 1%; Max Operating Temperature: 155°C; Datasheet: https://www.seielect.com/catalog/sei-rmcf_rmcp.pdf
R18 R24 R44 R47 = CMP-00039-1: Resistor, 0603, XX; Power: 100mW; Min Operating Temperature: -55°C; Max Operating Temperature: 155°C; Tolerance: 1%; Datasheet: https://www.seielect.com/catalog/sei-rmcf_rmcp.pdf
R31 R59 = CMP-00041-2: Resistor, 0603, 1%, 1/10W; Power: 100mW; Tolerance: 1%; Datasheet: https://www.seielect.com/catalog/sei-rmcf_rmcp.pdf; Max Operating Temperature: 155°C; Min Operating Temperature: -55°C
R52 = CMP-00018-2: Resistor, 0603, 1%, 1/10W; Power: 100mW; Min Operating Temperature: -55°C; Tolerance: 1%; Datasheet: https://www.seielect.com/catalog/sei-rmcf_rmcp.pdf; Max Operating Temperature: 155°C
U7 U8 = CMP-008-00016-1: as U5 on sheet Pump Fan Control; Min Operating Temperature: -40°C; Mounting Technology: Surface Mount; Max Operating Temperature: 85°C; RoHS Compliant: Yes
U9 = CMP-033-000000-2: Quad, General Purpose Differential Comparator; MF: Texas Instruments; Design Item ID: LM3302DR; SnapEDA_Link: https://www.snapeda.com/parts/LM3302DR/Texas+Instruments/view-part/?ref=snap; Component Type: Standard; Pin Count: 14; Price: None; Value: *; Check_prices: https://www.snapeda.com/parts/LM3302DR/Texas+Instruments/view-part/?ref=eda; Purchase-URL: https://pricing.snapeda.com/search/part/LM3302DR/?ref=eda; Package: SOIC-14 Texas Instruments; MP: LM3302DR; Source: LM3302DR.SchLib; Availability: In Stock
U10 = CMP-016-00011-1: MC14073BDG; Triple 3-Input AND Logic Gate; 3 - 18 V; 14-Pin SOIC; Max Supply Voltage: 18V; Min Supply Voltage: 3V; Logic Function: AND GATE; Low Level Output Current: 4.2mA; Number of Circuits: 3; High Level Output Current: -4.2mA; Length: 8.75mm; Lead Free: Lead Free; Max Operating Temperature: 125°C; Height: 1.5mm; Mounting Technology: Surface Mount; Case/Package: SOIC; Min Operating Temperature: -55°C
U11 = CMP-031-00010-1: Comparator General Purpose CMOS, DTL, ECL, Open-Collector, TTL SOT-23-5; Mfr_Name: STMicroelectronics; Copyright: Copyright (C) 2021 Ultra Librarian. All rights reserved.; Source: Zips_Racing_Electric.SchLib; Design Item ID: TS391IYLT; Manufacturer_Part_Number: TS391IYLT; Digi-Key_Part_Number_2: 497-10245-2-ND; Type: DEV; Digi-Key_Part_Number_1: 497-10245-1-ND; RefDes: RefDes; Digi-Key_Part_Number_3: 497-10245-6-ND
U12 = CMP-031-00013-2: IC GATE OR 1CH 2-INP 5SSOP; SourceLibrary: ROHM_2019-10-21; Vendor: ROHM Semiconductor; Built_By: EMA_Molly; Min Supply Voltage: 3V; Max Supply Voltage: 16V; RefDes: RefDes; Copyright: Copyright (C) 2018 Accelerated Designs. All rights reserved; Type: DEV; Case/Package: LSSOP; Source: Zips_Racing_Electric.SchLib; Design Item ID: BU4S71G2-TR; Manufacturer_Part_Number: BU4S71G2-TR; Min Operating Temperature: -40°C; RoHS Compliant: Yes; Pins: 5; Max Operating Temperature: 85°C

## Nets that join several sheets
+3V3: STM32 (29 pins), Pump Fan Control (C22.2 PS2.5), BSPD (U7.7)
+3V3 EXT: STM32 (C25.2 J1.H3 U6.1 U6.3), Pump Fan Control (C37.2 PS3.5)
+5V: STM32 (8 pins), Pump Fan Control (9 pins), BSPD (21 pins)
+24V: STM32 (J1.M1 R7.1 R29.1 R35.1), Pump Fan Control (5 pins), BSPD (D4.1 D5.1 U7.1 U8.1)
GND: STM32 (72 pins), Pump Fan Control (12 pins), BSPD (29 pins)
BS_IN: STM32 (J1.K4), BSPD (R26.1)
BSPD_MCU: STM32 (U2.58), BSPD (R1.1)
CS_IN: STM32 (J1.H4), BSPD (R58.1)
MCU_RESET: STM32 (U2.57), BSPD (Q3.3 R10.1 R11.1)
RESET_BTN: STM32 (J1.J4), BSPD (R13.1)
SD IN: STM32 (J1.G1), Pump Fan Control (U5.5)
SD OUT: STM32 (J1.H1), BSPD (U7.4)
SD_MCU: STM32 (U2.59), Pump Fan Control (R87.1)
SD_TO_BSPD: Pump Fan Control (U5.6), BSPD (U7.3)